# Altium schematic sheet OpAmp_Channnels.SchDoc
size A4; DocumentNumber: 9; SheetNumber: 9; SheetTotal: 11
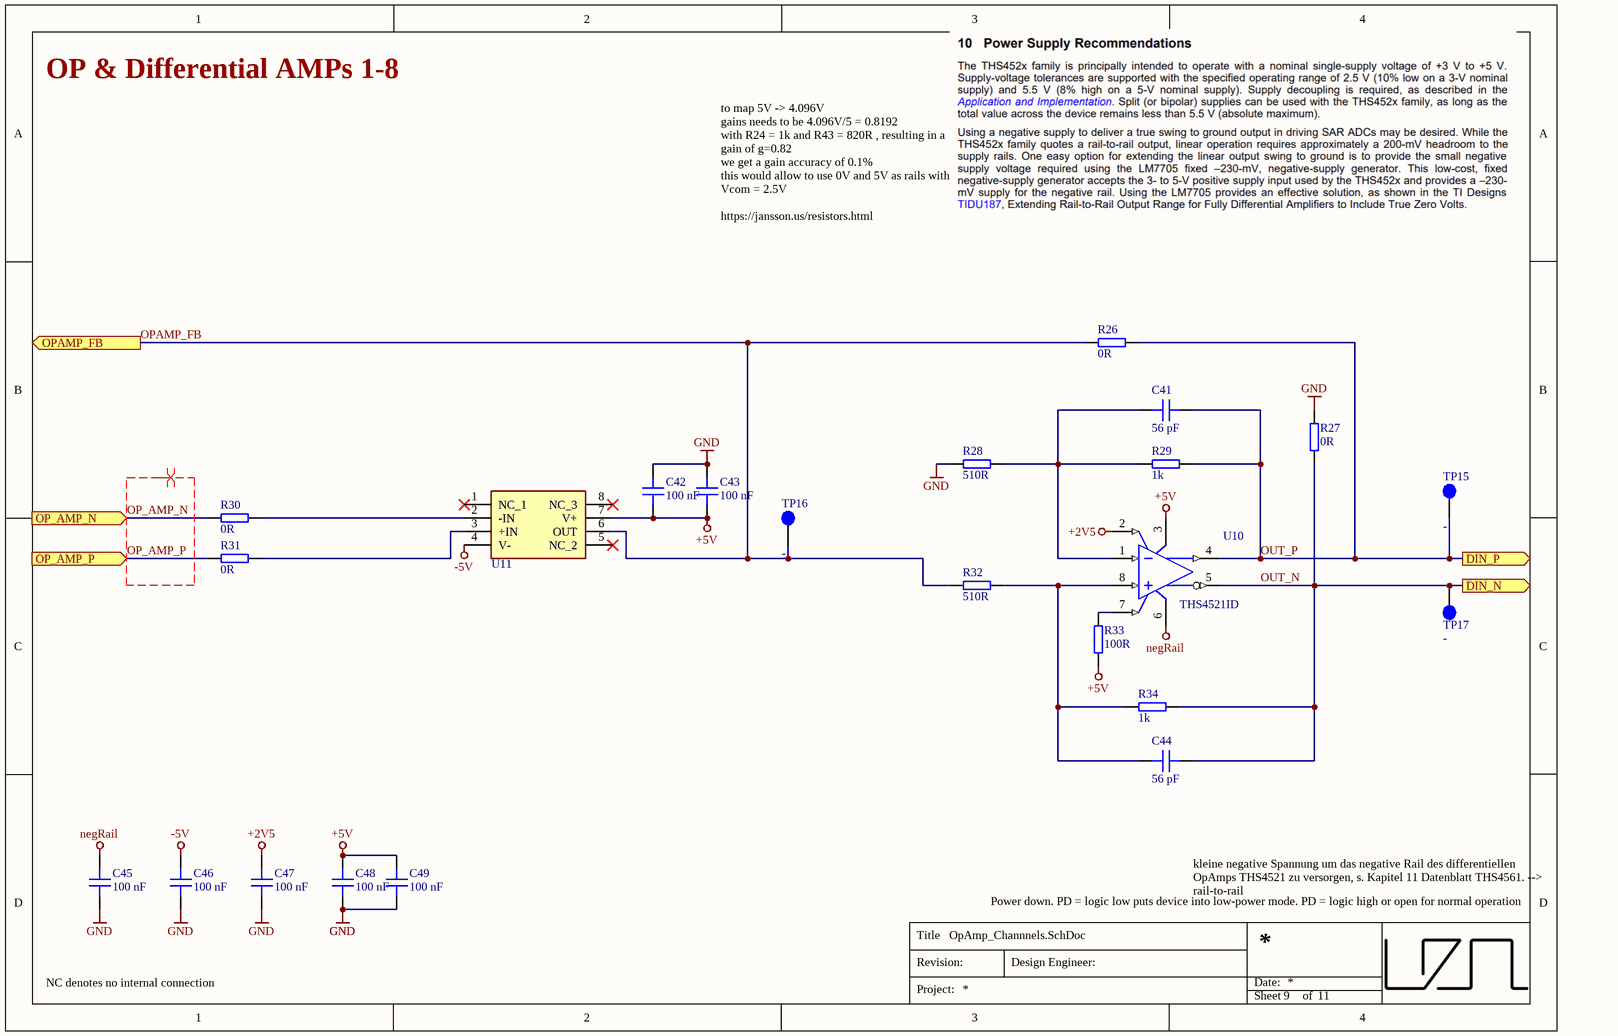
[diagram p0: OpAmp_Channnels.SchDoc]

## Parts
C41  56 pF  [C_0603]
C42  100 nF  [C_0603]
C43  100 nF  [C_0603]
C44  56 pF  [C_0603]
C45  100 nF  [C_0603]
C46  100 nF  [C_0603]
C47  100 nF  [C_0603]
C48  100 nF  [C_0603]
C49  100 nF  [C_0603]
R26  0R  [RES 0603_1608]
R27  0R  [RES 0603_1608]
R28  510R  [RES 0603_1608]
R29  1k  [RES 0603_1608]
R30  0R  [RES 0603_1608]
R31  0R  [RES 0603_1608]
R32  510R  [RES 0603_1608]
R33  100R  [RES 0603_1608]
R34  1k  [RES 0603_1608]
TP15  -  [TP_1mm]
TP16  -  [TP_1mm]
TP17  -  [TP_1mm]
U10  THS4521ID  [D0008A_M]
U11  OPA727AIDGKT  [SOP65P490X110-8N]  (value not drawn)

## Ports
DIN_N (out), DIN_P (out), OP_AMP_N (in), OP_AMP_P (in), OPAMP_FB (out)

## Nets
+2V5: C47.2 U10.2(VOCM)
+5V: C42.1 C43.1 C48.2 C49.2 R33.2 U10.3(VS+) U11.7(V+)
-5V: C46.2 U11.4(V-)
GND: C42.2 C43.2 C45.1 C46.1 C47.1 C48.1 C49.1 R27.2 R28.1
negRail: C45.2 U10.6(VS-)
OP_AMP_N: R30.1 ; port OP_AMP_N
OP_AMP_P: R31.1 ; port OP_AMP_P
OPAMP_FB: R26.1 R32.1 TP16.1 U11.6(OUT) ; port OPAMP_FB
OUT_N: C44.2 R27.1 R34.2 TP17.1 U10.5(VOUT-) ; port DIN_N
OUT_P: C41.2 R26.2 R29.2 TP15.1 U10.4(VOUT+) ; port DIN_P
NetC41_1: C41.1 R28.2 R29.1 U10.1(VIN-)
NetC44_1: C44.1 R32.2 R34.1 U10.8(VIN+)
NetR30_2: R30.2 U11.2(-IN)
NetR31_2: R31.2 U11.3(+IN)
NetR33_1: R33.1 U10.7(~{PD})

Not connected (* = marked no-connect by the designer): U11 1(NC_1)* 5(NC_2)* 8(NC_3)*

## Layout directives
differential pair: OP_AMP_N, OP_AMP_P

## Notes on the sheet
- OP & Differential AMPs 1-8
- to map 5V -> 4.096V
  gains needs to be 4.096V/5 = 0.8192
  with R24 = 1k and R43 = 820R , resulting in a gain of g=0.82
  we get a gain accuracy of 0.1%
  this would allow to use 0V and 5V as rails with Vcom = 2.5V
  https://jansson.us/resistors.html
- Power down. PD = logic low puts device into low-power mode. PD = logic high or open for normal operation
- kleine negative Spannung um das negative Rail des differentiellen OpAmps THS4521 zu versorgen, s. Kapitel 11 Datenblatt THS4561. --> rail-to-rail
- NC denotes no internal connection
- Title
- Revision:
- Design Engineer:
- Date:
- Project:
- Sheet
- of

## Library data of the parts
C41 C44 = VJ0603A560JXACW1BC: Capacitor 0603, 50 VDC, 56 pF, C0G; Manufacturer: Vishay; Tolerance: 5 %; Voltage Rating: 50 VDC; Created from: MGremer; Manufacturer Part Number: VJ0603A560JXACW1BC; PartID: 45; Created On: 20.12.2020 13:54:13; ComponentLink1Description: Datasheet; ComponentLink1URL: https://www.mouser.de/datasheet/2/427/vjw1bcbascomseries-1762447.pdf; Component Type: Capacitor 0603; Device Package: 0603; Last Updated: 20.12.2020 16:24:16; Mounting Type: SMD; Operating Temperature: -55 - 125°C; Series: VJ W1BC Basic Comm; Supplier 1: Mouser; Supplier Part Number 1: 77-VJ0603A560JXACBC; Type: Capacitor; Value: 56 pF; Live Cycle Status: 1; Stock number: not stored
C42 C43 C45-C49 = C0603C104K9PACTU: Capacitor 0603, 6.3 VDC, 100 nF, X5R; Manufacturer: KEMET; Tolerance: 10 %; Voltage Rating: 6.3 VDC; Created from: MGremer; Manufacturer Part Number: C0603C104K9PACTU; PartID: 70; Created On: 20.12.2020 13:54:13; ComponentLink1Description: Datasheet; ComponentLink1URL: https://www.mouser.de/datasheet/2/212/KEM_C1006_X5R_SMD-1103249.pdf; Component Type: Capacitor 0603; Device Package: 0603; Last Updated: 20.01.2021 13:57:36; Mounting Type: SMD; Operating Temperature: -55 - 85°C; Series: SMD Comm X5R; Supplier 1: Mouser; Supplier Part Number 1: 80-C0603C104K9P; Type: Capacitor; Value: 100 nF; Live Cycle Status: 1; Stock number: not stored
R26 R27 R30 R31 = RC0603JR-070RL: SMD resistor E24 series; Manufacturer: YAGEO; Tolerance: 5%; Created from: MGremer; Manufacturer Part Number: RC0603JR-070RL; PartID: 1; Created On: 14.12.2020 16:17:14; ComponentLink1Description: Datasheet; ComponentLink1URL: https://www.mouser.de/datasheet/2/447/PYu-RC_Group_51_RoHS_L_10-1664068.pdf; Component Type: SMD resistor; Device Package: 0603; Last Updated: 04.03.2021 09:09:42; Mounting Type: SMD; Supplier 1: Mouser; Supplier Part Number 1: 603-RC0603JR-070RL; Supplier 2: LCSC; Supplier Part Number 2: C21189; Type: Resistor; Value: 0R; Live Cycle Status: 1; Stock number: Labor SMD Container; LCSC Part Number: C21189
R28 R32 = RK73B1JTTD511J: SMD resistor E24 series; Manufacturer: KOA Speer; Tolerance: 5%; Created from: MGremer; Manufacturer Part Number: RK73B1JTTD511J; PartID: 67; Created On: 14.12.2020 16:17:14; ComponentLink1Description: Datasheet; ComponentLink1URL: https://www.mouser.de/datasheet/2/219/RK73B-1825463.pdf; Component Type: SMD resistor; Device Package: 0603; Last Updated: 02.03.2021 14:07:32; Mounting Type: SMD; Supplier 1: Mouser; Supplier Part Number 1: 660-RK73B1JTTD511J; Type: Resistor; Value: 510R; Live Cycle Status: 1; Stock number: Labor SMD Container
R29 R34 = RK73B1JTTDD102J: SMD resistor E24 series; Manufacturer: KOA Speer; Tolerance: 5%; Created from: MGremer; Manufacturer Part Number: RK73B1JTTDD102J; PartID: 74; Created On: 14.12.2020 16:17:14; ComponentLink1Description: Datasheet; ComponentLink1URL: https://www.mouser.de/datasheet/2/219/RK73B-1825463.pdf; Component Type: SMD resistor; Device Package: 0603; Last Updated: 02.03.2021 14:07:32; Mounting Type: SMD; Supplier 1: Mouser; Supplier Part Number 1: 660-RK73B1JTTDD102J; Type: Resistor; Value: 1k; Live Cycle Status: 1; Stock number: Labor SMD Container
R33 = AC0603FR-13100RL: SMD resistor 1%; Manufacturer: Yageo; Created from: MGremer; Manufacturer Part Number: AC0603FR-13100RL; PartID: 161; Created On: 14.12.2020 16:17:14; ComponentLink1Description: Datasheet; ComponentLink1URL: https://www.mouser.de/datasheet/2/447/PYu-AC_51_RoHS_L_7-1714230.pdf; Component Type: SMD resistor; Device Package: 0603; Last Updated: 02.03.2021 14:07:32; Mounting Type: SMD; Supplier 1: Mouser; Supplier Part Number 1: 603-AC0603FR-13100RL; Type: Resistor; Tolerance: 1%; Value: 100R; Live Cycle Status: 1; Stock number: not stored
TP15-TP17 = -: Test Point 1 mm; Value: TP; Created from: MGremer; Created: 2018_06_25_AGeiger; Manufacturer Part Number: -; PartID: 9; Created On: 02.03.2021 14:59:37; ComponentLink1Description: Datasheet; ComponentLink1URL: -; ComponentLink2Description: Homepage; ComponentLink2URL: -; Component Type: Test Point; Device Package: SMD; Last Updated: 03.11.2021 09:04:23; Manufacturer: -; Minimum Order: 1; Mounting Type: SMD; Supplier 1: -; Supplier Part Number 1: -; Type: Test point; Live Cycle Status: 1; Stock number: not stored
U10 = THS4521ID: Very Low Power, Negative Rail Input, Rail-To-Rail Output, Fully Differential Amplifier; Manufacturer: TI; Io(Typ)(mA): 55; Vs(Max)(V): 5.5; Eco-Plan: Green (RoHS & no Sb/Br); Iq per channel(Max)(mA): 1.25; Vn at Flatband(Typ)(nV/rtHz): 4.6; 2nd Harmonic(dBc): 133; Number of Channels: 1; Rail-Rail: Out; @ MHz: 0.01; Slew Rate(Typ)(V/us): 490; BW @ Acl(MHz): 145; Vs(Min)(V): 2.5; Vio(Max)(mV): 2; 3rd Harmonic(dBc): 140; Created from: MHlatky; ComponentLink2Description: Datasheet; Mounting Technology: Surface Mount; PackageReference: D0008A; ComponentLink1Description: Datasheet; SubFamily: Fully Differential Amplifier; DatasheetVersion: SBOS458F; Code_JEDEC: MS-012; ComponentLink3URL: http://www.ti.com/litv/pdf/msoi002j; PartNumber: THS4521ID; PackageDescription: 8-Pin Plastic Small Outline, Body 4.9 x 3.9 mm, Pitch 1.27 mm; ComponentLink1URL: https://www.ti.com/lit/ds/symlink/ths4521.pdf?HQS=dis-mous-null-mousermode-dsf-pf-null-wwe&ts=1646514637932&ref_url=https%253A%252F%252Fwww.mouser.de%252F; ComponentLink2URL: http://www.ti.com/general/docs/lit/getliterature.tsp?genericPartNumber=THS4521&fileType=pdf; ComponentLink3Description: Package Specification; PackageVersion: 4040047-3/M, 06/2011; Manufacturer Part Number: THS4521ID; PartID: 10; Created On: 03.03.2022 16:53:36; Component Type: THS4521ID; Last Updated: 08.03.2022 12:27:24; Mounting Type: SOIC; Operating Temperature: -40 - 85; Supplier 1: Mouser; Supplier Part Number 1: 595-THS4521ID; Type: Differential Amplifier; Live Cycle Status: 1
U11 = OPA727AIDGKT: e-trim™ 20MHz, High Precision CMOS Operational Amplifier; Manufacturer_Name: Texas Instruments; Manufacturer: TI; Created from: MHlatky; Datasheet Link: http://www.ti.com/lit/ds/symlink/opa727.pdf; Height: 1.1mm; Manufacturer_Part_Number: OPA727AIDGKT; Manufacturer Part Number: OPA727AIDGKT; PartID: 7; Created On: 03.03.2022 16:53:36; ComponentLink1Description: Datasheet; ComponentLink1URL: https://www.ti.com/lit/ds/symlink/opa727.pdf?HQS=dis-mous-null-mousermode-dsf-pf-null-wwe&ts=1646513691709&ref_url=https%253A%252F%252Fwww.mouser.de%252F; Component Type: OPA727AIDGKT; Last Updated: 03.03.2022 16:54:19; Mounting Type: SOP; Operating Temperature: -40 - 125; Supplier 1: Mouser; Supplier Part Number 1: 595-OPA727AIDGKT; Type: OpAmp; Live Cycle Status: 1